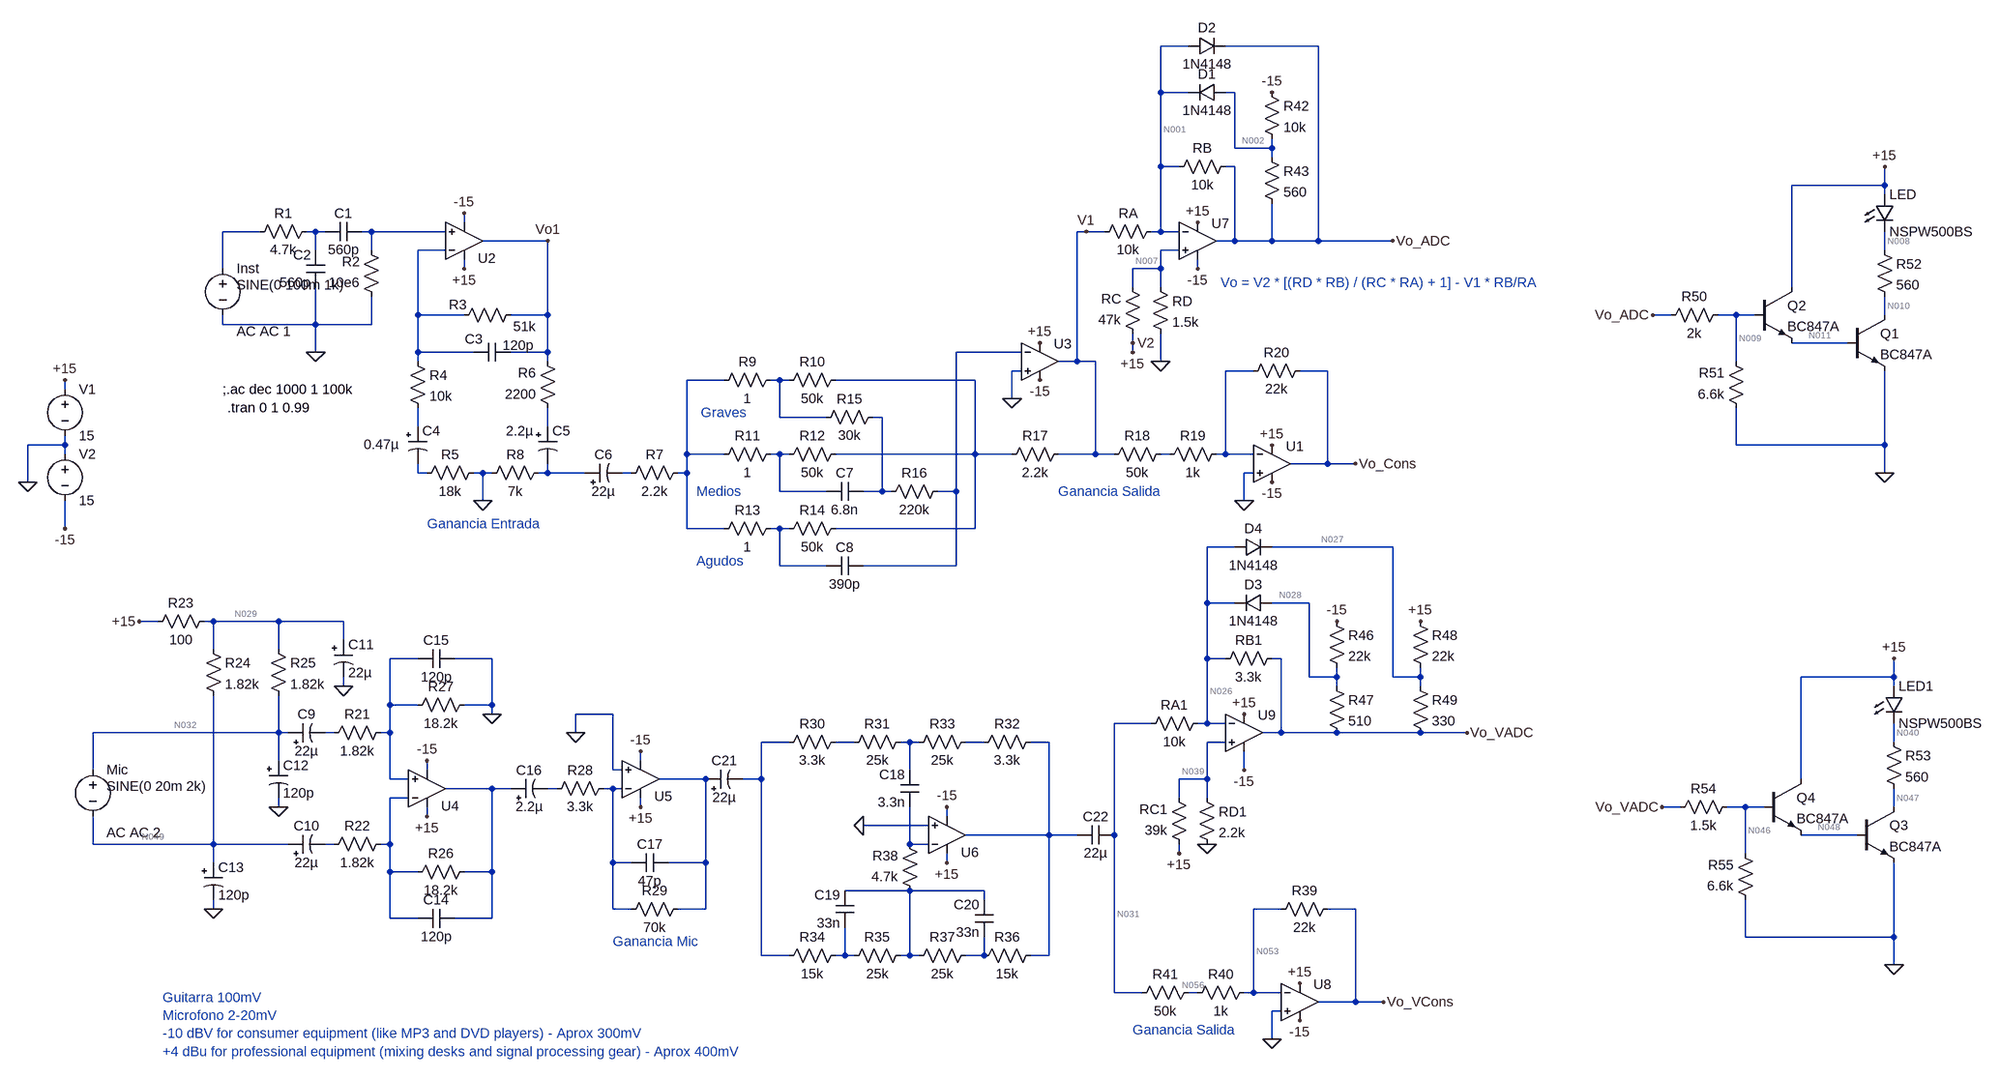
[diagram p0: schematic Amp_Comun+Voz+Limit_V2.asc]
Amp_Comun+Voz+Limit_V2.asc, the LTspice schematic file:
Version 4
SHEET 1 2868 1556
WIRE 1360 -208 1312 -208
WIRE 1584 -208 1424 -208
WIRE 1312 -128 1312 -208
WIRE 1360 -128 1312 -128
WIRE 1440 -128 1424 -128
WIRE 1440 -32 1440 -128
WIRE 1504 -32 1504 -48
WIRE 1504 -32 1440 -32
WIRE 1504 -16 1504 -32
WIRE 1312 0 1312 -128
WIRE 1344 0 1312 0
WIRE 1440 0 1424 0
WIRE 2560 32 2560 0
WIRE 2560 32 2400 32
WIRE 2560 48 2560 32
WIRE 112 96 112 80
WIRE -240 112 -304 112
WIRE -144 112 -160 112
WIRE -128 112 -144 112
WIRE -48 112 -64 112
WIRE 80 112 -48 112
WIRE 1184 112 1168 112
WIRE 1216 112 1184 112
WIRE 1312 112 1312 0
WIRE 1312 112 1296 112
WIRE 1344 112 1312 112
WIRE 256 128 144 128
WIRE 1440 128 1440 0
WIRE 1440 128 1408 128
WIRE 1504 128 1504 64
WIRE 1504 128 1440 128
WIRE 1584 128 1584 -208
WIRE 1584 128 1504 128
WIRE 1712 128 1584 128
WIRE -144 144 -144 112
WIRE -48 144 -48 112
WIRE 80 144 32 144
WIRE 1344 144 1312 144
WIRE 2560 144 2560 112
WIRE -304 176 -304 112
WIRE 112 176 112 160
WIRE 1312 176 1312 144
WIRE 1312 176 1264 176
WIRE 1376 176 1376 160
WIRE 1264 208 1264 176
WIRE 1312 208 1312 176
WIRE 2400 208 2400 32
WIRE 32 256 32 144
WIRE 112 256 32 256
WIRE 256 256 256 128
WIRE 256 256 192 256
WIRE 2192 256 2160 256
WIRE 2304 256 2272 256
WIRE 2336 256 2304 256
WIRE 2560 256 2560 224
WIRE -304 272 -304 256
WIRE -144 272 -144 208
WIRE -144 272 -304 272
WIRE -48 272 -48 224
WIRE -48 272 -144 272
WIRE 1264 304 1264 288
WIRE 2496 304 2400 304
WIRE -144 320 -144 272
WIRE 32 320 32 256
WIRE 128 320 32 320
WIRE 256 320 256 256
WIRE 256 320 192 320
WIRE 1072 320 960 320
WIRE 1264 320 1264 304
WIRE 32 336 32 320
WIRE 256 336 256 320
WIRE 1168 336 1168 112
WIRE 1168 336 1136 336
WIRE 1200 336 1168 336
WIRE 1312 336 1312 288
WIRE 2304 336 2304 256
WIRE 1072 352 1056 352
WIRE 1472 352 1424 352
WIRE 1600 352 1552 352
WIRE 560 368 496 368
WIRE 656 368 640 368
WIRE 672 368 656 368
WIRE 992 368 752 368
WIRE -576 384 -576 368
WIRE 1056 400 1056 352
WIRE 656 432 656 368
WIRE 736 432 656 432
WIRE 832 432 816 432
WIRE 32 448 32 416
WIRE 256 448 256 416
WIRE -576 480 -576 464
WIRE -576 480 -640 480
WIRE 2304 480 2304 416
WIRE 2560 480 2560 352
WIRE 2560 480 2304 480
WIRE -576 496 -576 480
WIRE 496 496 496 368
WIRE 560 496 496 496
WIRE 656 496 640 496
WIRE 672 496 656 496
WIRE 992 496 992 368
WIRE 992 496 752 496
WIRE 1056 496 992 496
WIRE 1200 496 1200 336
WIRE 1200 496 1136 496
WIRE 1232 496 1200 496
WIRE 1328 496 1312 496
WIRE 1424 496 1424 352
WIRE 1424 496 1408 496
WIRE 1472 496 1424 496
WIRE 1600 512 1600 352
WIRE 1600 512 1536 512
WIRE 1648 512 1600 512
WIRE 32 528 32 512
WIRE 48 528 32 528
WIRE 144 528 128 528
WIRE 160 528 144 528
WIRE 256 528 256 512
WIRE 256 528 240 528
WIRE 320 528 256 528
WIRE 400 528 384 528
WIRE 496 528 496 496
WIRE 496 528 480 528
WIRE 1472 528 1456 528
WIRE 2560 528 2560 480
WIRE -640 544 -640 480
WIRE 656 560 656 496
WIRE 736 560 656 560
WIRE 832 560 832 432
WIRE 832 560 800 560
WIRE 848 560 832 560
WIRE 960 560 960 320
WIRE 960 560 928 560
WIRE 144 576 144 528
WIRE 1456 576 1456 528
WIRE -576 624 -576 576
WIRE 496 624 496 528
WIRE 560 624 496 624
WIRE 656 624 640 624
WIRE 672 624 656 624
WIRE 992 624 992 496
WIRE 992 624 752 624
WIRE 1440 656 1392 656
WIRE 1712 656 1504 656
WIRE 656 688 656 624
WIRE 736 688 656 688
WIRE 960 688 960 560
WIRE 960 688 800 688
WIRE 1392 752 1392 656
WIRE 1440 752 1392 752
WIRE 1568 752 1504 752
WIRE -416 784 -448 784
WIRE -320 784 -336 784
WIRE -208 784 -320 784
WIRE -96 784 -208 784
WIRE -96 816 -96 784
WIRE -320 832 -320 784
WIRE -208 832 -208 784
WIRE 32 848 -16 848
WIRE 160 848 96 848
WIRE 1392 848 1392 752
WIRE 1424 848 1392 848
WIRE 1520 848 1504 848
WIRE 1568 880 1568 752
WIRE 1616 880 1616 864
WIRE 1616 880 1568 880
WIRE 1712 880 1712 656
WIRE 1760 880 1760 864
WIRE 1760 880 1712 880
WIRE 2576 880 2576 848
WIRE 2576 880 2416 880
WIRE -96 896 -96 880
WIRE 1616 896 1616 880
WIRE 1760 896 1760 880
WIRE 2576 896 2576 880
WIRE -16 928 -16 848
WIRE 32 928 -16 928
WIRE 160 928 160 848
WIRE 160 928 112 928
WIRE 160 944 160 928
WIRE 368 944 304 944
WIRE 1296 960 1232 960
WIRE 1392 960 1392 848
WIRE 1392 960 1376 960
WIRE 1424 960 1392 960
WIRE -208 976 -208 912
WIRE -208 976 -528 976
WIRE -192 976 -208 976
WIRE -112 976 -128 976
WIRE -16 976 -16 928
WIRE -16 976 -32 976
WIRE 304 976 304 944
WIRE 1520 976 1520 848
WIRE 1520 976 1488 976
WIRE 1616 976 1520 976
WIRE 1760 976 1616 976
WIRE 1840 976 1760 976
WIRE 672 992 624 992
WIRE 784 992 752 992
WIRE 880 992 864 992
WIRE 896 992 880 992
WIRE 1008 992 976 992
WIRE 1120 992 1088 992
WIRE 1424 992 1392 992
WIRE 2576 992 2576 960
WIRE -208 1024 -208 976
WIRE 416 1024 416 1008
WIRE -528 1040 -528 976
WIRE 48 1040 48 1024
WIRE 368 1040 368 944
WIRE 384 1040 368 1040
WIRE 880 1040 880 992
WIRE 1456 1040 1456 1008
WIRE -16 1056 -16 976
WIRE 16 1056 -16 1056
WIRE 528 1056 448 1056
WIRE 624 1056 624 992
WIRE 624 1056 592 1056
WIRE 1392 1056 1392 992
WIRE 1392 1056 1344 1056
WIRE 2416 1056 2416 880
WIRE 160 1072 80 1072
WIRE 192 1072 160 1072
WIRE 272 1072 256 1072
WIRE 368 1072 352 1072
WIRE 384 1072 368 1072
WIRE 16 1088 -16 1088
WIRE 1344 1088 1344 1056
WIRE 1392 1088 1392 1056
WIRE -208 1104 -208 1088
WIRE 416 1104 416 1088
WIRE 2208 1104 2176 1104
WIRE 2320 1104 2288 1104
WIRE 2352 1104 2320 1104
WIRE 2576 1104 2576 1072
WIRE 48 1120 48 1104
WIRE 944 1120 944 1104
WIRE 912 1136 800 1136
WIRE 1120 1152 1120 992
WIRE 1120 1152 976 1152
WIRE 1168 1152 1120 1152
WIRE 1232 1152 1232 960
WIRE 2512 1152 2416 1152
WIRE -528 1168 -528 1120
WIRE -320 1168 -320 912
WIRE -320 1168 -528 1168
WIRE -192 1168 -320 1168
WIRE -112 1168 -128 1168
WIRE -16 1168 -16 1088
WIRE -16 1168 -32 1168
WIRE 880 1168 880 1104
WIRE 912 1168 880 1168
WIRE 1344 1184 1344 1168
WIRE 2320 1184 2320 1104
WIRE -320 1200 -320 1168
WIRE 368 1200 368 1072
WIRE 400 1200 368 1200
WIRE 528 1200 528 1056
WIRE 528 1200 464 1200
WIRE 944 1200 944 1184
WIRE -16 1216 -16 1168
WIRE 32 1216 -16 1216
WIRE 160 1216 160 1072
WIRE 160 1216 112 1216
WIRE 880 1248 768 1248
WIRE 1008 1248 880 1248
WIRE 1008 1264 1008 1248
WIRE -320 1280 -320 1264
WIRE 368 1280 368 1200
WIRE 400 1280 368 1280
WIRE 528 1280 528 1200
WIRE 528 1280 480 1280
WIRE 1520 1280 1472 1280
WIRE 1648 1280 1600 1280
WIRE -16 1296 -16 1216
WIRE 32 1296 -16 1296
WIRE 160 1296 160 1216
WIRE 160 1296 96 1296
WIRE 2320 1328 2320 1264
WIRE 2576 1328 2576 1200
WIRE 2576 1328 2320 1328
WIRE 624 1360 624 1056
WIRE 672 1360 624 1360
WIRE 768 1360 768 1312
WIRE 768 1360 752 1360
WIRE 784 1360 768 1360
WIRE 880 1360 880 1248
WIRE 880 1360 864 1360
WIRE 896 1360 880 1360
WIRE 1008 1360 1008 1328
WIRE 1008 1360 976 1360
WIRE 1120 1360 1120 1152
WIRE 1120 1360 1088 1360
WIRE 2576 1376 2576 1328
WIRE 1232 1424 1232 1152
WIRE 1280 1424 1232 1424
WIRE 1376 1424 1360 1424
WIRE 1472 1424 1472 1280
WIRE 1472 1424 1456 1424
WIRE 1520 1424 1472 1424
WIRE 1648 1440 1648 1280
WIRE 1648 1440 1584 1440
WIRE 1696 1440 1648 1440
WIRE 1520 1456 1504 1456
WIRE 1504 1504 1504 1456
FLAG 112 176 +15
FLAG -576 368 +15
FLAG -576 624 -15
FLAG 112 80 -15
FLAG -640 544 0
FLAG -144 320 0
FLAG 144 576 0
FLAG 1104 304 +15
FLAG 1104 368 -15
FLAG 1056 400 0
FLAG 256 128 Vo1
FLAG 1712 128 Vo_ADC
FLAG 1504 480 +15
FLAG 1504 544 -15
FLAG 1456 576 0
FLAG 1648 512 Vo_Cons
FLAG 48 1120 +15
FLAG 48 1024 -15
FLAG -448 784 +15
FLAG -96 896 0
FLAG -208 1104 0
FLAG -320 1280 0
FLAG 160 944 0
FLAG 416 1104 +15
FLAG 416 1008 -15
FLAG 304 976 0
FLAG 944 1200 +15
FLAG 944 1104 -15
FLAG 800 1136 0
FLAG 1376 96 +15
FLAG 1312 336 0
FLAG 1264 320 +15
FLAG 1184 112 V1
FLAG 1264 304 V2
FLAG 1552 1408 +15
FLAG 1552 1472 -15
FLAG 1504 1504 0
FLAG 1696 1440 Vo_VCons
FLAG 1840 976 Vo_VADC
FLAG 1456 944 +15
FLAG 1392 1168 0
FLAG 1344 1184 +15
FLAG 1504 -128 -15
FLAG 1616 784 -15
FLAG 1760 784 +15
FLAG 2160 256 Vo_ADC
FLAG 2560 0 +15
FLAG 2560 528 0
FLAG 2176 1104 Vo_VADC
FLAG 2576 848 +15
FLAG 2576 1376 0
FLAG 1456 1040 -15
FLAG 1376 176 -15
SYMBOL voltage -576 368 R0
WINDOW 123 0 0 Left 0
WINDOW 39 0 0 Left 0
SYMATTR InstName V1
SYMATTR Value 15
SYMBOL voltage -576 480 R0
WINDOW 123 0 0 Left 0
WINDOW 39 0 0 Left 0
SYMATTR InstName V2
SYMATTR Value 15
SYMBOL voltage -304 160 R0
WINDOW 123 24 124 Left 2
WINDOW 39 0 0 Left 0
WINDOW 3 24 44 Left 2
SYMATTR Value2 AC AC 1
SYMATTR Value SINE(0 100m 1k)
SYMATTR InstName Inst
SYMBOL res -144 96 R90
WINDOW 0 0 56 VBottom 2
WINDOW 3 32 56 VTop 2
SYMATTR InstName R1
SYMATTR Value 4.7k
SYMBOL res -32 240 R180
WINDOW 0 36 76 Left 2
WINDOW 3 36 40 Left 2
SYMATTR InstName R2
SYMATTR Value 10e6
SYMBOL res 96 272 R270
WINDOW 0 18 5 VTop 2
WINDOW 3 12 120 VBottom 2
SYMATTR InstName R3
SYMATTR Value 51k
SYMBOL res 16 320 R0
SYMATTR InstName R4
SYMATTR Value 10k
SYMBOL res 272 432 R180
WINDOW 0 36 76 Left 2
WINDOW 3 36 40 Left 2
SYMATTR InstName R6
SYMATTR Value 2200
SYMBOL res 384 544 R270
WINDOW 0 32 56 VTop 2
WINDOW 3 0 56 VBottom 2
SYMATTR InstName R7
SYMATTR Value 2.2k
SYMBOL cap -64 96 R90
WINDOW 0 0 32 VBottom 2
WINDOW 3 32 32 VTop 2
SYMATTR InstName C1
SYMATTR Value 560p
SYMBOL cap -128 208 R180
WINDOW 0 24 56 Left 2
WINDOW 3 24 8 Left 2
SYMATTR InstName C2
SYMATTR Value 560p
SYMBOL cap 128 336 R270
WINDOW 0 23 1 VTop 2
WINDOW 3 43 77 VBottom 2
SYMATTR InstName C3
SYMATTR Value 120p
SYMBOL polcap 16 448 R0
WINDOW 3 -77 31 Left 2
SYMATTR Value 0.47µ
SYMATTR InstName C4
SYMBOL polcap 240 448 R0
WINDOW 3 -56 8 Left 2
SYMATTR Value 2.2µ
SYMATTR InstName C5
SYMBOL polcap 320 544 R270
WINDOW 0 32 32 VTop 2
WINDOW 3 0 32 VBottom 2
SYMATTR InstName C6
SYMATTR Value 22µ
SYMBOL OpAmps\\UniversalOpamp2 112 128 M180
WINDOW 0 24 -30 Left 2
SYMATTR InstName U2
SYMBOL res 144 512 R90
WINDOW 0 0 56 VBottom 2
WINDOW 3 32 56 VTop 2
SYMATTR InstName R5
SYMATTR Value 18k
SYMBOL res 256 512 R90
WINDOW 0 0 56 VBottom 2
WINDOW 3 32 56 VTop 2
SYMATTR InstName R8
SYMATTR Value 7k
SYMBOL res 656 352 R90
WINDOW 0 0 56 VBottom 2
WINDOW 3 32 56 VTop 2
SYMATTR InstName R9
SYMATTR Value 1
SYMBOL res 768 352 R90
WINDOW 0 0 56 VBottom 2
WINDOW 3 32 56 VTop 2
SYMATTR InstName R10
SYMATTR Value 50k
SYMBOL res 656 480 R90
WINDOW 0 0 56 VBottom 2
WINDOW 3 32 56 VTop 2
SYMATTR InstName R11
SYMATTR Value 1
SYMBOL res 768 480 R90
WINDOW 0 0 56 VBottom 2
WINDOW 3 32 56 VTop 2
SYMATTR InstName R12
SYMATTR Value 50k
SYMBOL res 656 608 R90
WINDOW 0 0 56 VBottom 2
WINDOW 3 32 56 VTop 2
SYMATTR InstName R13
SYMATTR Value 1
SYMBOL res 768 608 R90
WINDOW 0 0 56 VBottom 2
WINDOW 3 32 56 VTop 2
SYMATTR InstName R14
SYMATTR Value 50k
SYMBOL cap 800 544 R90
WINDOW 0 0 32 VBottom 2
WINDOW 3 32 32 VTop 2
SYMATTR InstName C7
SYMATTR Value 6.8n
SYMBOL cap 800 672 R90
WINDOW 0 0 32 VBottom 2
WINDOW 3 32 32 VTop 2
SYMATTR InstName C8
SYMATTR Value 390p
SYMBOL res 832 416 R90
WINDOW 0 0 56 VBottom 2
WINDOW 3 32 56 VTop 2
SYMATTR InstName R15
SYMATTR Value 30k
SYMBOL res 944 544 R90
WINDOW 0 0 56 VBottom 2
WINDOW 3 32 56 VTop 2
SYMATTR InstName R16
SYMATTR Value 220k
SYMBOL OpAmps\\UniversalOpamp2 1104 336 R0
WINDOW 0 24 -30 Left 2
SYMATTR InstName U3
SYMBOL res 1152 480 R90
WINDOW 0 0 56 VBottom 2
WINDOW 3 32 56 VTop 2
SYMATTR InstName R17
SYMATTR Value 2.2k
SYMBOL OpAmps\\UniversalOpamp2 1504 512 R0
WINDOW 0 24 -30 Left 2
SYMATTR InstName U1
SYMBOL res 1328 480 R90
WINDOW 0 0 56 VBottom 2
WINDOW 3 32 56 VTop 2
SYMATTR InstName R18
SYMATTR Value 50k
SYMBOL res 1568 336 R90
WINDOW 0 0 56 VBottom 2
WINDOW 3 32 56 VTop 2
SYMATTR InstName R20
SYMATTR Value 22k
SYMBOL res 1424 480 R90
WINDOW 0 0 56 VBottom 2
WINDOW 3 32 56 VTop 2
SYMATTR InstName R19
SYMATTR Value 1k
SYMBOL voltage -528 1024 R0
WINDOW 123 24 124 Left 2
WINDOW 39 0 0 Left 0
WINDOW 3 24 44 Left 2
SYMATTR Value2 AC AC 2
SYMATTR Value SINE(0 20m 2k)
SYMATTR InstName Mic
SYMBOL OpAmps\\UniversalOpamp2 48 1072 M180
WINDOW 0 24 -30 Left 2
SYMATTR InstName U4
SYMBOL res -128 992 R270
WINDOW 0 32 56 VTop 2
WINDOW 3 0 56 VBottom 2
SYMATTR InstName R21
SYMATTR Value 1.82k
SYMBOL polcap -192 992 R270
WINDOW 0 32 32 VTop 2
WINDOW 3 0 32 VBottom 2
SYMATTR InstName C9
SYMATTR Value 22µ
SYMBOL res -128 1184 R270
WINDOW 0 32 56 VTop 2
WINDOW 3 0 56 VBottom 2
SYMATTR InstName R22
SYMATTR Value 1.82k
SYMBOL polcap -192 1184 R270
WINDOW 0 32 32 VTop 2
WINDOW 3 0 32 VBottom 2
SYMATTR InstName C10
SYMATTR Value 22µ
SYMBOL res -320 768 R90
WINDOW 0 0 56 VBottom 2
WINDOW 3 32 56 VTop 2
SYMATTR InstName R23
SYMATTR Value 100
SYMBOL res -336 816 R0
SYMATTR InstName R24
SYMATTR Value 1.82k
SYMBOL res -224 816 R0
SYMATTR InstName R25
SYMATTR Value 1.82k
SYMBOL polcap -112 816 R0
SYMATTR InstName C11
SYMATTR Value 22µ
SYMBOL polcap -224 1024 R0
SYMATTR InstName C12
SYMATTR Value 120p
SYMBOL polcap -336 1200 R0
SYMATTR InstName C13
SYMATTR Value 120p
SYMBOL res 16 1232 R270
WINDOW 0 32 56 VTop 2
WINDOW 3 0 56 VBottom 2
SYMATTR InstName R26
SYMATTR Value 18.2k
SYMBOL cap 96 1280 R90
WINDOW 0 0 32 VBottom 2
WINDOW 3 32 32 VTop 2
SYMATTR InstName C14
SYMATTR Value 120p
SYMBOL res 16 944 R270
WINDOW 0 32 56 VTop 2
WINDOW 3 0 56 VBottom 2
SYMATTR InstName R27
SYMATTR Value 18.2k
SYMBOL cap 96 832 R90
WINDOW 0 0 32 VBottom 2
WINDOW 3 32 32 VTop 2
SYMATTR InstName C15
SYMATTR Value 120p
SYMBOL OpAmps\\UniversalOpamp2 416 1056 M180
WINDOW 0 24 -30 Left 2
SYMATTR InstName U5
SYMBOL res 256 1088 R270
WINDOW 0 32 56 VTop 2
WINDOW 3 0 56 VBottom 2
SYMATTR InstName R28
SYMATTR Value 3.3k
SYMBOL polcap 192 1088 R270
WINDOW 0 32 32 VTop 2
WINDOW 3 0 32 VBottom 2
SYMATTR InstName C16
SYMATTR Value 2.2µ
SYMBOL res 496 1264 R90
WINDOW 0 0 56 VBottom 2
WINDOW 3 32 56 VTop 2
SYMATTR InstName R29
SYMATTR Value 70k
SYMBOL cap 464 1184 R90
WINDOW 0 0 32 VBottom 2
WINDOW 3 32 32 VTop 2
SYMATTR InstName C17
SYMATTR Value 47p
SYMBOL res 768 976 R90
WINDOW 0 0 56 VBottom 2
WINDOW 3 32 56 VTop 2
SYMATTR InstName R30
SYMATTR Value 3.3k
SYMBOL res 880 976 R90
WINDOW 0 0 56 VBottom 2
WINDOW 3 32 56 VTop 2
SYMATTR InstName R31
SYMATTR Value 25k
SYMBOL res 1104 976 R90
WINDOW 0 0 56 VBottom 2
WINDOW 3 32 56 VTop 2
SYMATTR InstName R32
SYMATTR Value 3.3k
SYMBOL res 992 976 R90
WINDOW 0 0 56 VBottom 2
WINDOW 3 32 56 VTop 2
SYMATTR InstName R33
SYMATTR Value 25k
SYMBOL cap 896 1104 R180
WINDOW 0 24 56 Left 2
WINDOW 3 24 8 Left 2
SYMATTR InstName C18
SYMATTR Value 3.3n
SYMBOL OpAmps\\UniversalOpamp2 944 1152 M180
WINDOW 0 24 -30 Left 2
SYMATTR InstName U6
SYMBOL res 768 1344 R90
WINDOW 0 0 56 VBottom 2
WINDOW 3 32 56 VTop 2
SYMATTR InstName R34
SYMATTR Value 15k
SYMBOL res 880 1344 R90
WINDOW 0 0 56 VBottom 2
WINDOW 3 32 56 VTop 2
SYMATTR InstName R35
SYMATTR Value 25k
SYMBOL res 1104 1344 R90
WINDOW 0 0 56 VBottom 2
WINDOW 3 32 56 VTop 2
SYMATTR InstName R36
SYMATTR Value 15k
SYMBOL res 992 1344 R90
WINDOW 0 0 56 VBottom 2
WINDOW 3 32 56 VTop 2
SYMATTR InstName R37
SYMATTR Value 25k
SYMBOL cap 784 1312 R180
WINDOW 0 24 56 Left 2
WINDOW 3 24 8 Left 2
SYMATTR InstName C19
SYMATTR Value 33n
SYMBOL cap 1024 1328 R180
WINDOW 0 24 56 Left 2
WINDOW 3 24 8 Left 2
SYMATTR InstName C20
SYMATTR Value 33n
SYMBOL res 896 1264 R180
WINDOW 0 36 76 Left 2
WINDOW 3 36 40 Left 2
SYMATTR InstName R38
SYMATTR Value 4.7k
SYMBOL polcap 528 1072 R270
WINDOW 0 32 32 VTop 2
WINDOW 3 0 32 VBottom 2
SYMATTR InstName C21
SYMATTR Value 22µ
SYMBOL OpAmps\\UniversalOpamp2 1376 128 R0
WINDOW 0 24 -30 Left 2
SYMATTR InstName U7
SYMBOL res 1280 304 R180
WINDOW 0 36 76 Left 2
WINDOW 3 36 40 Left 2
SYMATTR InstName RC
SYMATTR Value 47k
SYMBOL res 1296 192 R0
SYMATTR InstName RD
SYMATTR Value 1.5k
SYMBOL res 1200 128 R270
WINDOW 0 32 56 VTop 2
WINDOW 3 0 56 VBottom 2
SYMATTR InstName RA
SYMATTR Value 10k
SYMBOL res 1328 16 R270
WINDOW 0 32 56 VTop 2
WINDOW 3 0 56 VBottom 2
SYMATTR InstName RB
SYMATTR Value 10k
SYMBOL OpAmps\\UniversalOpamp2 1552 1440 R0
WINDOW 0 24 -30 Left 2
SYMATTR InstName U8
SYMBOL res 1616 1264 R90
WINDOW 0 0 56 VBottom 2
WINDOW 3 32 56 VTop 2
SYMATTR InstName R39
SYMATTR Value 22k
SYMBOL res 1472 1408 R90
WINDOW 0 0 56 VBottom 2
WINDOW 3 32 56 VTop 2
SYMATTR InstName R40
SYMATTR Value 1k
SYMBOL res 1376 1408 R90
WINDOW 0 0 56 VBottom 2
WINDOW 3 32 56 VTop 2
SYMATTR InstName R41
SYMATTR Value 50k
SYMBOL OpAmps\\UniversalOpamp2 1456 976 R0
WINDOW 0 24 -30 Left 2
SYMATTR InstName U9
SYMBOL res 1360 1184 R180
WINDOW 0 36 76 Left 2
WINDOW 3 36 40 Left 2
SYMATTR InstName RC1
SYMATTR Value 39k
SYMBOL res 1376 1072 R0
SYMATTR InstName RD1
SYMATTR Value 2.2k
SYMBOL res 1280 976 R270
WINDOW 0 32 56 VTop 2
WINDOW 3 0 56 VBottom 2
SYMATTR InstName RA1
SYMATTR Value 10k
SYMBOL res 1408 864 R270
WINDOW 0 32 56 VTop 2
WINDOW 3 0 56 VBottom 2
SYMATTR InstName RB1
SYMATTR Value 3.3k
SYMBOL cap 1168 1168 R270
WINDOW 0 32 32 VTop 2
WINDOW 3 0 32 VBottom 2
SYMATTR InstName C22
SYMATTR Value 22µ
SYMBOL res 1488 -144 R0
SYMATTR InstName R42
SYMATTR Value 10k
SYMBOL res 1488 -32 R0
SYMATTR InstName R43
SYMATTR Value 560
SYMBOL diode 1424 -144 R90
WINDOW 0 0 32 VBottom 2
WINDOW 3 32 32 VTop 2
SYMATTR InstName D1
SYMATTR Value 1N4148
SYMBOL res 1600 768 R0
SYMATTR InstName R46
SYMATTR Value 22k
SYMBOL res 1600 880 R0
SYMATTR InstName R47
SYMATTR Value 510
SYMBOL diode 1504 736 R90
WINDOW 0 0 32 VBottom 2
WINDOW 3 32 32 VTop 2
SYMATTR InstName D3
SYMATTR Value 1N4148
SYMBOL diode 1360 -192 R270
WINDOW 0 32 32 VTop 2
WINDOW 3 0 32 VBottom 2
SYMATTR InstName D2
SYMATTR Value 1N4148
SYMBOL res 1744 768 R0
SYMATTR InstName R48
SYMATTR Value 22k
SYMBOL res 1744 880 R0
SYMATTR InstName R49
SYMATTR Value 330
SYMBOL diode 1440 672 R270
WINDOW 0 32 32 VTop 2
WINDOW 3 0 32 VBottom 2
SYMATTR InstName D4
SYMATTR Value 1N4148
SYMBOL npn 2496 256 R0
SYMATTR InstName Q1
SYMATTR Value BC847A
SYMBOL res 2544 128 R0
SYMATTR InstName R52
SYMATTR Value 560
SYMBOL LED 2544 48 R0
SYMATTR InstName LED
SYMATTR Value NSPW500BS
SYMBOL npn 2336 208 R0
SYMATTR InstName Q2
SYMATTR Value BC847A
SYMBOL res 2288 240 R90
WINDOW 0 0 56 VBottom 2
WINDOW 3 32 56 VTop 2
SYMATTR InstName R50
SYMATTR Value 2k
SYMBOL res 2320 432 R180
WINDOW 0 36 76 Left 2
WINDOW 3 36 40 Left 2
SYMATTR InstName R51
SYMATTR Value 6.6k
SYMBOL npn 2512 1104 R0
SYMATTR InstName Q3
SYMATTR Value BC847A
SYMBOL res 2560 976 R0
SYMATTR InstName R53
SYMATTR Value 560
SYMBOL LED 2560 896 R0
SYMATTR InstName LED1
SYMATTR Value NSPW500BS
SYMBOL npn 2352 1056 R0
SYMATTR InstName Q4
SYMATTR Value BC847A
SYMBOL res 2304 1088 R90
WINDOW 0 0 56 VBottom 2
WINDOW 3 32 56 VTop 2
SYMATTR InstName R54
SYMATTR Value 1.5k
SYMBOL res 2336 1280 R180
WINDOW 0 36 76 Left 2
WINDOW 3 36 40 Left 2
SYMATTR InstName R55
SYMATTR Value 6.6k
TEXT -304 384 Left 2 !;.ac dec 1000 1 100k
TEXT 512 680 Left 2 ;Agudos
TEXT 512 560 Left 2 ;Medios
TEXT 520 424 Left 2 ;Graves
TEXT 48 616 Left 2 ;Ganancia Entrada
TEXT 1136 560 Left 2 ;Ganancia Salida
TEXT 368 1336 Left 2 ;Ganancia Mic
TEXT -296 416 Left 2 !.tran 0 1 0.99
TEXT -408 1432 Left 2 ;Guitarra 100mV\nMicrofono 2-20mV\n-10 dBV for consumer equipment (like MP3 and DVD players) - Aprox 300mV\n+4 dBu for professional equipment (mixing desks and signal processing gear) - Aprox 400mV
TEXT 1416 200 Left 2 ;Vo = V2 * [(RD * RB) / (RC * RA) + 1] - V1 * RB/RA
TEXT 1264 1488 Left 2 ;Ganancia Salida

The netlist it stands for:
* Amp_Comun+Voz+Limit_V2.asc
V1 V2 0 15
V2 0 -15 15
V§Inst N003 0 SINE(0 100m 1k) AC AC 1
R1 N004 N003 4.7k
R2 0 N005 10e6
R3 N006 Vo1 51k
R4 N006 N018 10k
R6 N019 Vo1 2200
R7 N024 N014 2.2k
C1 N005 N004 560p
C2 0 N004 560p
C3 N006 Vo1 120p
C4 N018 N022 0.47µ
C5 N019 N023 2.2µ
C6 N023 N024 22µ
XU2 N005 N006 V2 -15 Vo1 level.2 Avol=1Meg GBW=10Meg Slew=10Meg ilimit=25m rail=0 Vos=0 phimargin=45 en=0 enk=0 in=0 ink=0 Rin=500Meg  ; pins IN+ IN- V+ V- OUT
R5 0 N022 18k
R8 N023 0 7k
R9 N015 N014 1
R10 N016 N015 50k
R11 N020 N014 1
R12 N016 N020 50k
R13 N025 N014 1
R14 N016 N025 50k
C7 N017 N020 6.8n
C8 N012 N025 390p
R15 N017 N015 30k
R16 N012 N017 220k
XU3 0 N012 V2 -15 V1 level.2 Avol=1Meg GBW=10Meg Slew=10Meg ilimit=25m rail=0 Vos=0 phimargin=45 en=0 enk=0 in=0 ink=0 Rin=500Meg  ; pins IN+ IN- V+ V- OUT
R17 V1 N016 2.2k
XU1 0 N013 V2 -15 Vo_Cons level.2 Avol=1Meg GBW=10Meg Slew=10Meg ilimit=25m rail=0 Vos=0 phimargin=45 en=0 enk=0 in=0 ink=0 Rin=500Meg  ; pins IN+ IN- V+ V- OUT
R18 N021 V1 50k
R20 Vo_Cons N013 22k
R19 N013 N021 1k
V§Mic N032 N049 SINE(0 20m 2k) AC AC 2
XU4 N030 N045 V2 -15 N042 level.2 Avol=1Meg GBW=10Meg Slew=10Meg ilimit=25m rail=0 Vos=0 phimargin=45 en=0 enk=0 in=0 ink=0 Rin=500Meg  ; pins IN+ IN- V+ V- OUT
R21 N033 N030 1.82k
C9 N032 N033 22µ
R22 N050 N045 1.82k
C10 N049 N050 22µ
R23 N029 V2 100
R24 N029 N049 1.82k
R25 N029 N032 1.82k
C11 N029 0 22µ
C12 N032 0 120p
C13 N049 0 120p
R26 N045 N042 18.2k
C14 N042 N045 120p
R27 N030 0 18.2k
C15 0 N030 120p
XU5 0 N044 V2 -15 N041 level.2 Avol=1Meg GBW=10Meg Slew=10Meg ilimit=25m rail=0 Vos=0 phimargin=45 en=0 enk=0 in=0 ink=0 Rin=500Meg  ; pins IN+ IN- V+ V- OUT
R28 N043 N044 3.3k
C16 N042 N043 2.2µ
R29 N041 N044 70k
C17 N041 N044 47p
R30 N035 N034 3.3k
R31 N036 N035 25k
R32 N038 N037 3.3k
R33 N037 N036 25k
C18 N051 N036 3.3n
XU6 0 N051 V2 -15 N038 level.2 Avol=1Meg GBW=10Meg Slew=10Meg ilimit=25m rail=0 Vos=0 phimargin=45 en=0 enk=0 in=0 ink=0 Rin=500Meg  ; pins IN+ IN- V+ V- OUT
R34 N054 N034 15k
R35 N052 N054 25k
R36 N038 N055 15k
R37 N055 N052 25k
C19 N054 N052 33n
C20 N055 N052 33n
R38 N052 N051 4.7k
C21 N041 N034 22µ
XU7 N007 N001 V2 -15 Vo_ADC level.2 Avol=1Meg GBW=10Meg Slew=10Meg ilimit=25m rail=0 Vos=0 phimargin=45 en=0 enk=0 in=0 ink=0 Rin=500Meg  ; pins IN+ IN- V+ V- OUT
RC V2 N007 47k
RD N007 0 1.5k
RA V1 N001 10k
RB N001 Vo_ADC 10k
XU8 0 N053 V2 -15 Vo_VCons level.2 Avol=1Meg GBW=10Meg Slew=10Meg ilimit=25m rail=0 Vos=0 phimargin=45 en=0 enk=0 in=0 ink=0 Rin=500Meg  ; pins IN+ IN- V+ V- OUT
R39 Vo_VCons N053 22k
R40 N053 N056 1k
R41 N056 N031 50k
XU9 N039 N026 V2 -15 Vo_VADC level.2 Avol=1Meg GBW=10Meg Slew=10Meg ilimit=25m rail=0 Vos=0 phimargin=45 en=0 enk=0 in=0 ink=0 Rin=500Meg  ; pins IN+ IN- V+ V- OUT
RC1 V2 N039 39k
RD1 N039 0 2.2k
RA1 N031 N026 10k
RB1 N026 Vo_VADC 3.3k
C22 N038 N031 22µ
R42 -15 N002 10k
R43 N002 Vo_ADC 560
D1 N002 N001 1N4148
R46 -15 N028 22k
R47 N028 Vo_VADC 510
D3 N028 N026 1N4148
D2 N001 Vo_ADC 1N4148
R48 V2 N027 22k
R49 N027 Vo_VADC 330
D4 N026 N027 1N4148
Q1 N010 N011 0 0 BC847A
R52 N008 N010 560
D§LED V2 N008 NSPW500BS
Q2 V2 N009 N011 0 BC847A
R50 N009 Vo_ADC 2k
R51 0 N009 6.6k
Q3 N047 N048 0 0 BC847A
R53 N040 N047 560
D§LED1 V2 N040 NSPW500BS
Q4 V2 N046 N048 0 BC847A
R54 N046 Vo_VADC 1.5k
R55 0 N046 6.6k
.model D D
.lib standard.dio
.model NPN NPN
.model PNP PNP
.lib standard.bjt
;.ac dec 1000 1 100k
* Agudos
* Medios
* Graves
* Ganancia Entrada
* Ganancia Salida
* Ganancia Mic
.tran 0 1 0.99
* Guitarra 100mV
* Microfono 2-20mV
* -10 dBV for consumer equipment (like MP3 and DVD players) - Aprox 300mV
* +4 dBu for professional equipment (mixing desks and signal processing gear) - Aprox 400mV
* Vo = V2 * [(RD * RB) / (RC * RA) + 1] - V1 * RB/RA
* Ganancia Salida
.lib UniversalOpamps2.sub
.backanno
.end

* Results of the author's LTspice run, read from the files saved beside the schematic
* Operating Point, zero values left out:
*   V(v2) = 15 V
*   V(-15) = -15 V
*   V(n032) = 15 V
*   V(n049) = 15 V
*   V(n029) = 15 V
*   V(vo_adc) = 927.8 mV
*   V(n001) = 463.9 mV
*   V(n007) = 463.9 mV
*   V(vo_vcons) = -288.9 mV
*   V(n053) = 289.4 nV
*   V(n056) = 13.13 mV
*   V(n031) = 669.7 mV
*   V(vo_vadc) = 844.3 mV
*   V(n026) = 801 mV
*   V(n039) = 801 mV
*   V(n002) = 83.18 mV
*   V(n028) = 485.3 mV
*   V(n027) = 1.053 V
*   V(n010) = 13.88 V
*   V(n011) = 424 mV
*   V(n008) = 13.88 V
*   V(n009) = 712.1 mV
*   V(n047) = 13.96 V
*   V(n048) = 412 mV
*   V(n040) = 13.96 V
*   V(n046) = 688 mV
*   Ic(Q4) = 512.2 pA
*   Ib(Q4) = -15.67 pA
*   Ie(Q4) = -496.6 pA
*   Ic(Q3) = 98.31 nA
*   Ib(Q3) = 496.6 pA
*   Ie(Q3) = -98.8 nA
*   Ic(Q2) = 810.6 pA
*   Ib(Q2) = -13.83 pA
*   Ie(Q2) = -796.8 pA
*   Ic(Q1) = 156.4 nA
*   Ib(Q1) = 796.8 pA
*   Ie(Q1) = -157.2 nA
*   I(Led1) = 98.31 nA
*   I(Led) = 156.4 nA
*   I(D4) = -2.511 nA
*   I(D2) = -2.52 nA
*   I(D3) = -2.518 nA
*   I(D1) = -2.52 nA
*   I(R55) = -104.2 µA
*   I(R54) = -104.2 µA
*   I(R53) = 98.31 nA
*   I(R51) = -107.9 µA
*   I(R50) = -107.9 µA
*   I(R52) = 156.4 nA
*   I(R49) = 633.9 µA
*   I(R48) = 633.9 µA
*   I(R47) = -703.9 µA
*   I(R46) = -703.9 µA
*   I(R43) = -1.508 mA
*   I(R42) = -1.508 mA
*   I(Rb1) = -13.13 µA
*   I(Ra1) = -13.13 µA
*   I(Rd1) = 364.1 µA
*   I(Rc1) = 364.1 µA
*   I(R41) = -13.13 µA
*   I(R40) = -13.13 µA
*   I(R39) = -13.13 µA
*   I(Rb) = -46.39 µA
*   I(Ra) = -46.39 µA
*   I(Rd) = 309.3 µA
*   I(Rc) = 309.3 µA
*   I(V2) = -15.01 mA
*   I(V1) = -15.9 mA
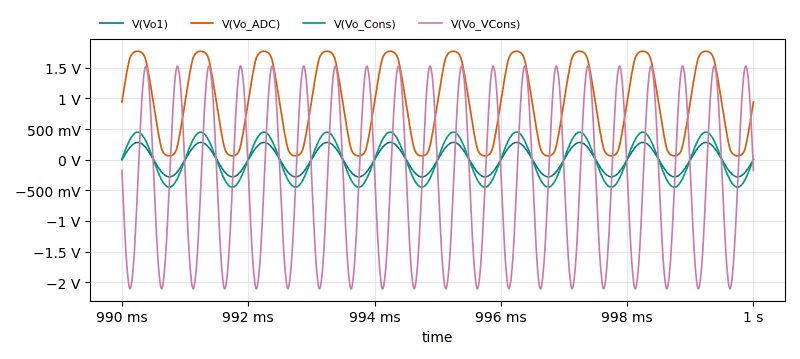
[diagram p1: Transient Analysis of Amp_Comun+Voz+Limit_V2.asc, plotted from the saved traces]
* Transient Analysis, 1 run:
*   V(Vo1): min -281.6 mV, max 281.6 mV, average 38.82 µV, rms 199 mV, last -1.383 mV
*   V(Vo_ADC): min 62.41 mV, max 1.771 V, average 922.2 mV, rms 1.134 V, last 942.9 mV
*   V(Vo_Cons): min -449.9 mV, max 449.9 mV, average 58.3 µV, rms 317.9 mV, last 6.698 mV
*   V(Vo_VCons): min -2.11 V, max 1.53 V, average -287 mV, rms 1.316 V, last -175.8 mV